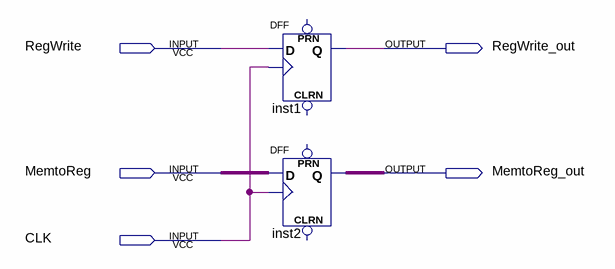
[diagram p0: schematic sheet]
// Quartus schematic MEM_WB_control.bdf as structural Verilog: 2 symbols, 5 pins
module MEM_WB_control (
  input  RegWrite,
  input  MemtoReg,
  input  CLK,
  output RegWrite_out,
  output MemtoReg_out
);

  DFF inst1 (.CLK(CLK), .D(RegWrite), .Q(RegWrite_out));  // open: CLRN, PRN
  DFF inst2 (.CLK(CLK), .D(MemtoReg), .Q(MemtoReg_out));  // open: CLRN, PRN
endmodule
